# EAGLE schematic buck (EAGLE 9.6.0)
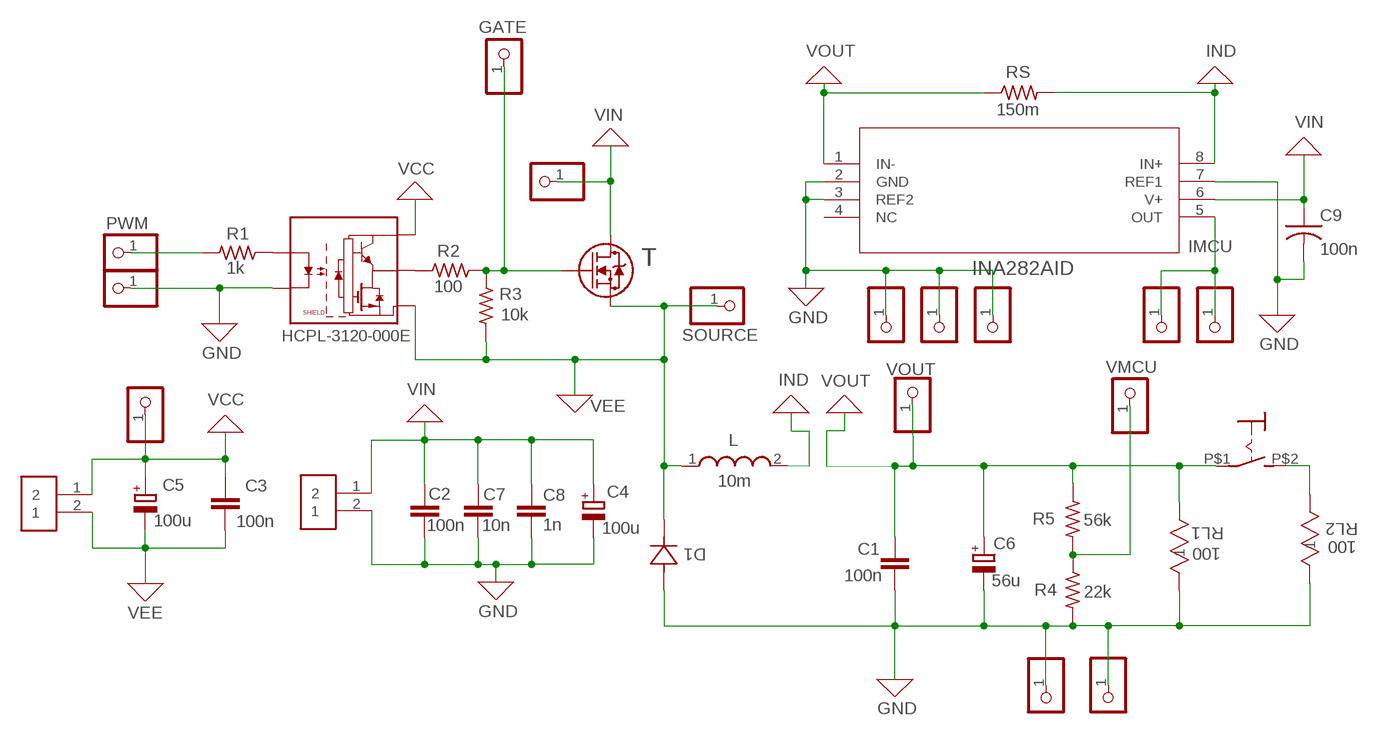
[diagram p0: schematic, sheet 1]

## Parts
C1  100n  C5/2.5  [C5B2.5]
C2  100n  C5/2.5  [C5B2.5]
C3  100n  C5/2.5  [C5B2.5]
C4  100u  CPOL-EUE5-6  [E5-6]
C5  100u  CPOL-EUE5-6  [E5-6]
C6  56u  CPOL-EUE5-6  [E5-6]
C7  10n  C5/2.5  [C5B2.5]
C8  1n  C5/2.5  [C5B2.5]
C9  100n  C-USC1206K  [C1206K]
D1  SB340-E3/54  [DIODE_DO-201AD]
GATE  PINHD-1X1  [1X01]
GDRVR  282837-2  [TE_282837-2]
GND  PINHD-1X1  [1X01]
GND2  PINHD-1X1  [1X01]
L  10m  1140-103K-RC  [INDRD2921W163D3810H2616P]
R1  1k  R_X0207/10C  [0207/10C]
R2  100  R_X0207/10C  [0207/10C]
R3  10k  R_X0207/10C  [0207/10C]
R4  22k  R_X0207/10C  [0207/10C]
R5  56k  R_X0207/10C  [0207/10C]
R7  PINHD-1X1  [1X01]
R9  PINHD-1X1  [1X01]
R10  PINHD-1X1  [1X01]
R11  PINHD-1X1  [1X01]
R12  PINHD-1X1  [1X01]
R13  PINHD-1X1  [1X01]
R14  PINHD-1X1  [1X01]
R15  PINHD-1X1  [1X01]
RL1  100  AC05000001000JAC00  [RES_AC05]
RL2  100  SQP500JB-22R  [YAG_SQP500]
RS  150m  R-US_M1206  [M1206]
SOURCE  PINHD-1X1  [1X01]
T  MOSFETMOSFET  [MOSFET]
U1  HCPL-3120-000E  [DIP762W65P254L990H470Q8]
U2  INA282AID  [D8]
U$1  ON_OFF  [ON_OFF]
V_IN  282837-2  [TE_282837-2]
VCC  PINHD-1X1  [1X01]
VIN  PINHD-1X1  [1X01]
VMCU  PINHD-1X1  [1X01]

## Nets
G: GATE.1 R2.2 R3.2 T.G
GND: C1.2 C2.2 C4.- C6.- C7.2 C8.2 C9.2 D1.2 GND2.1 GND.1 R4.1 R10.1 R11.1 R12.1 R13.1 RL1.1 RL2.1 U1.3(CATHODE) U2.2(GND) U2.3(REF2) U2.7(REF1) V_IN.2
IMCU: R14.1 R15.1 U2.5(OUT)
IND: L.2 RS.2 U2.8(IN+) ; supply symbol labelled GND
N$2: R2.1 U1.6(VO) U1.7(VO)
N$3: R1.2 U1.2(ANODE)
N$4: RL2.2 U$1.P$2(S)
PWM: R1.1 R9.1
VCC: C3.1 C5.+ GDRVR.1 U1.8(VCC) VCC.1 ; supply symbol labelled GND
VEE: C3.2 C5.- D1.1 GDRVR.2 L.1 R3.1 SOURCE.1 T.S U1.5(VEE) ; supply symbol labelled GND
VIN: C2.1 C4.+ C7.1 C8.1 C9.1 T.D U2.6(V+) V_IN.1 VIN.1 ; supply symbol labelled GND
VMCU: R4.2 R5.1 VMCU.1
VOUT: C1.1 C6.+ R5.2 R7.1 RL1.2 RS.1 U2.1(IN-) U$1.P$1(P) ; supply symbol labelled GND
Unconnected: U2.4(NC)

## Library data of the parts
C1-C3 C7 C8 = buck_converter:C: CAPACITOR naming: grid - package width
C4-C6 = buck_converter:CPOL-EU: POLARIZED CAPACITOR, European symbol; SPICEPREFIX: C
C9 = adafruit:C-US: CAPACITOR, American symbol
D1 = buck_converter:SB340-E3/54; BUILT_BY: EMA_UL_Team; MANUFACTURER_PART_NUMBER: SB340-E3/54; VENDOR: Vishay
GATE GND GND2 R7 R9-R15 SOURCE VCC VIN VMCU = pinhead:PINHD-1X1: PIN HEADER
GDRVR V_IN = buck_converter:282837-2: TERM BLOCK 5.08MM 2POS SIDE ENTY; COMMENT: 282837-2; DESCRIPTION: Connector Terminal Blocks Receptacle 2 Position 5.08mm Solder Straight Thru-Hole 13.5A/Contact; DIGI-KEY_PART_NUMBER: A113320-ND; DIGI-KEY_PURCHASE_URL: https://www.digikey.fr/product-detail/en/te-connectivity-amp-connectors/282837-2/A113320-ND/2187973?utm_source=snapeda&utm_medium=aggregator&utm_campaign=symbol; MF: TE Connectivity; MP: 282837-2; PACKAGE: None; TE_PURCHASE_URL: https://www.te.com/usa-en/product-282837-2.html?te_bu=Cor&te_type=disp&te_campaign=seda_glo_cor-seda-global-disp-prtnr-fy19-seda-model-bom-cta_sma-317_1&elqCampaignId=32493
L = buck_converter:1140-103K-RC: Ind High Current RF Choke Bobbin Core 100uH 10% 1KHz Ferrite 14.4A RDL; DESCRIPTION: 10mH Unshielded Wirewound Inductor 1A 2.76Ohm Max Radial, Vertical Cylinder; DIGI-KEY_PART_NUMBER: M8386-ND; DIGI-KEY_PURCHASE_URL: https://www.digikey.fr/product-detail/en/bourns-inc/1140-103K-RC/M8386-ND/774926?utm_source=snapeda&utm_medium=aggregator&utm_campaign=symbol; MF: Bourns; MP: 1140-103K-RC; PACKAGE: Radial Bourns
R1-R5 = buck_converter:R_: RESISTOR
RL1 = buck_converter:AC05000001000JAC00; BUILT_BY: EMA_UL_Team; MANUFACTURER_PART_NUMBER: AC05000001000JAC00; VENDOR: Vishay
RL2 = buck_converter:SQP500JB-22R; BUILT_BY: EMA_UL_Team; MANUFACTURER_PART_NUMBER: SQP500JB-22R; VENDOR: Yageo
RS = adafruit:R-US_: RESISTOR, American symbol
T = buck_converter:MOSFET
U1 = buck_converter:HCPL-3120-000E: Optocoupler; THT; Channels: 1; Out: IGBT driver; 3.75kV; DIP8; DESCRIPTION: 2.5A Gate Driver Optical Coupling 3750Vrms 1 Channel 8-DIP; DIGI-KEY_PART_NUMBER: 516-1476-5-ND; DIGI-KEY_PURCHASE_URL: https://www.digikey.com/product-detail/en/broadcom-limited/HCPL-3120-000E/516-1476-5-ND/669903?utm_source=snapeda&utm_medium=aggregator&utm_campaign=symbol; MF: Broadcom Limited; MP: HCPL-3120-000E; PACKAGE: DIP-8 Avago
U2 = buck_converter:INA282AID; DATASHEET_URL: http://www.ti.com/lit/gpn/INA282; DESCRIPTION: Wide Common Mode Range, Bidirectional, High Accuracy Current Shunt Monitor; FAMILY_NAME: CURRENT SHUNT MONITOR; GENERIC_PART_NUMBER: INA282; INDUSTRY_STD_PKG_TYPE: SOIC; MANUFACTURER: Texas Instruments; MANUFACTURER_PART_NUMBER: INA282AID; PACKAGE_DESIGNATOR: D; PIN_COUNT: 8; VENDOR: Texas Instruments
U$1 = buck_converter:ON_OFF